# Altium schematic sheet chip.SchDoc
size A; SheetNumber: 1; SheetTotal: 2
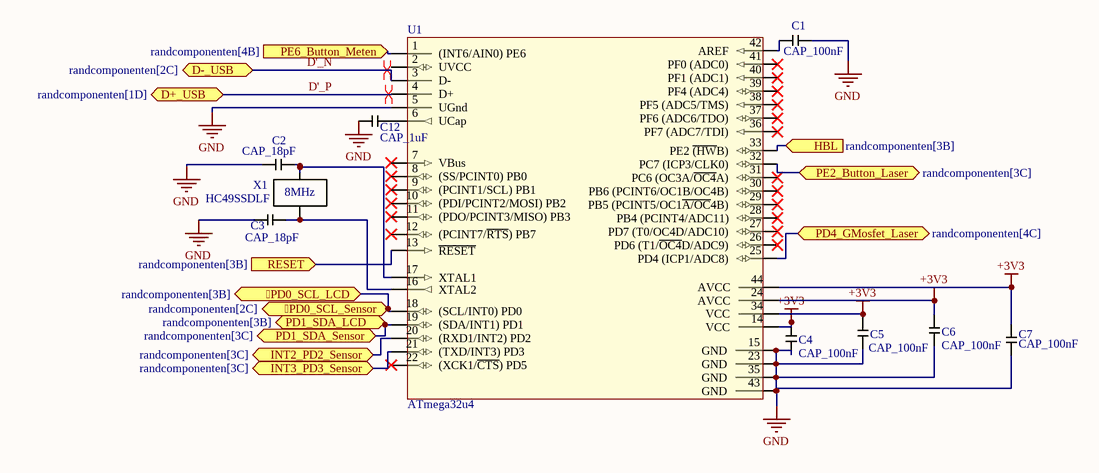
[diagram p0: chip.SchDoc]

## Parts
C1  CAP_100nF  [CAP_100nF]
C2  CAP_18pF  [CAP_18pF]
C3  CAP_18pF  [CAP_18pF]
C4  CAP_100nF  [CAP_100nF]
C5  CAP_100nF  [CAP_100nF]
C6  CAP_100nF  [CAP_100nF]
C7  CAP_100nF  [CAP_100nF]
C12  CAP_1uF  [CAP_1uF]
U1  ATmega32u4  [Atmega32u4]
X1  HC49SSDLF  [Xtal_HC49SSDLF]

## Ports
PD0_SCL_LCD (bidir, see randcomponenten[3B]), PD0_SCL_Sensor (bidir, see randcomponenten[2C]), D+_USB (bidir, see randcomponenten[1D]), D-_USB (bidir, see randcomponenten[2C]), HBL (in, see randcomponenten[3B]), INT2_PD2_Sensor (bidir, see randcomponenten[3C]), INT3_PD3_Sensor (bidir, see randcomponenten[3C]), PD1_SDA_LCD (bidir, see randcomponenten[3B]), PD1_SDA_Sensor (bidir, see randcomponenten[3C]), PD4_GMosfet_Laser (bidir, see randcomponenten[4C]), PE2_Button_Laser (bidir, see randcomponenten[3C]), PE6_Button_Meten (in, see randcomponenten[4B]), RESET (in, see randcomponenten[3B])

## Nets
+3V3: C4.1 C5.1 C6.1 C7.2 U1.14(VCC) U1.24(AVCC) U1.34(VCC) U1.44(AVCC)
GND: C1.2 C2.2 C3.2 C4.2 C5.2 C6.2 C7.1 C12.1 U1.5(UGnd) U1.15(GND) U1.23(GND) U1.35(GND) U1.43(GND)
PD0_SCL_LCD: U1.18((SCL/INT0)_PD0) ; port PD0_SCL_Sensor, port PD0_SCL_LCD
D'_N: U1.3(D-) ; port D-_USB
D'_P: U1.4(D+) ; port D+_USB
HBL: U1.33(PE2_~{(HW}B)) ; port HBL
INT2_PD2_Sensor: U1.20((RXD1/INT2)_PD2) ; port INT2_PD2_Sensor
INT3_PD3_Sensor: U1.21((TXD/INT3)_PD3) ; port INT3_PD3_Sensor
PD1_SDA_LCD: U1.19((SDA/INT1)_PD1) ; port PD1_SDA_Sensor, port PD1_SDA_LCD
PD4_GMosfet_Laser: U1.25(PD4_(ICP1/ADC8)) ; port PD4_GMosfet_Laser
PE2_Button_Laser: U1.32(PC7_(ICP3/CLK0)) ; port PE2_Button_Laser
PE6_Button_Meten: U1.1((INT6/AIN0)_PE6) ; port PE6_Button_Meten
RESET: U1.13(~{RESET}) ; port RESET
NetC1_1: C1.1 U1.42(AREF)
NetC2_1: C2.1 U1.17(XTAL1) X1.1(Xtal_1)
NetC3_1: C3.1 U1.16(XTAL2) X1.2(Xtal__2)
NetC12_2: C12.2 U1.6(UCap)

Not connected (* = marked no-connect by the designer): U1 2(UVCC) 7(VBus)* 8((SS/PCINT0)_PB0)* 9((PCINT1/SCL)_PB1)* 10((PDI/PCINT2/MOSI)_PB2)* 11((PDO/PCINT3/MISO)_PB3)* 12((PCINT7/~{RTS})_PB7)* 22((XCK1/~{CTS})_PD5)* 26(PD6_(T1/~{OC4}D/ADC9))* 27(PD7_(T0/OC4D/ADC10))* 28(PB4_(PCINT4/ADC11))* 29(PB5_(PCINT5/OC1~{A/OC}4B))* 30(PB6_(PCINT6/OC1B/OC4B))* 31(PC6_(OC3A/~{OC4}A))* 36(PF7_(ADC7/TDI))* 37(PF6_(ADC6/TDO))* 38(PF5_(ADC5/TMS))* 39(PF4_(ADC4))* 40(PF1_(ADC1))* 41(PF0_(ADC0))*

## Layout directives
differential pair: D'_N, D'_P

## Notes on the sheet
- (in symbol XTAL_8MHz) 8MHz

## Library data of the parts
X1 = XTAL_8MHz